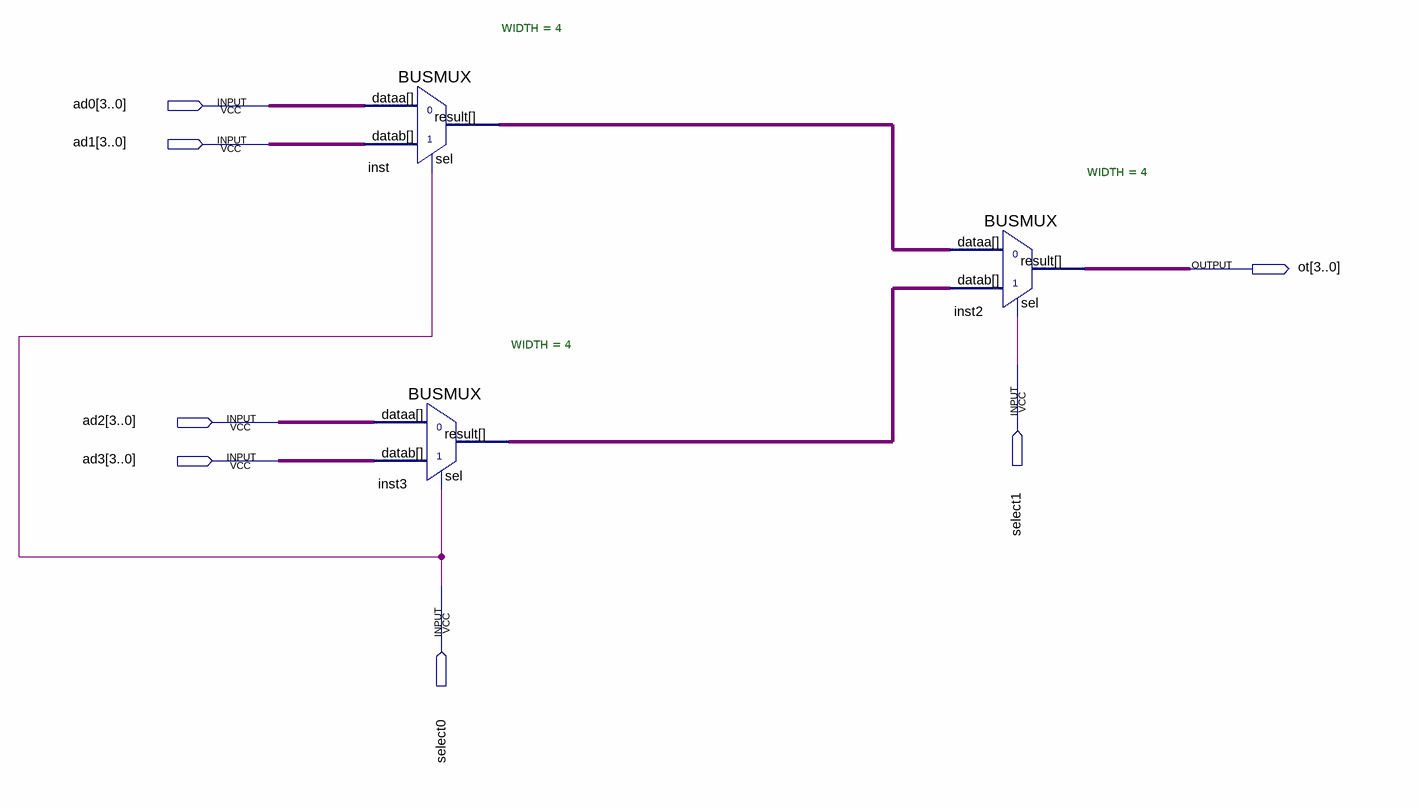
[diagram p0: schematic sheet]
// Quartus schematic MUX.bdf as structural Verilog: 3 symbols, 7 pins
module MUX (
  input  [3:0] ad0,
  input  [3:0] ad1,
  input  select1,
  input  [3:0] ad2,
  input  [3:0] ad3,
  input  select0,
  output [3:0] ot
);

  wire [3:0] inst3_result, inst_result;

  BUSMUX #(.WIDTH(4)) inst (.datab(ad1), .sel(select0), .dataa(ad0), .result(inst_result));
  BUSMUX #(.WIDTH(4)) inst3 (.datab(ad3), .sel(select0), .dataa(ad2), .result(inst3_result));
  BUSMUX #(.WIDTH(4)) inst2 (.datab(inst3_result), .sel(select1), .dataa(inst_result), .result(ot));
endmodule
